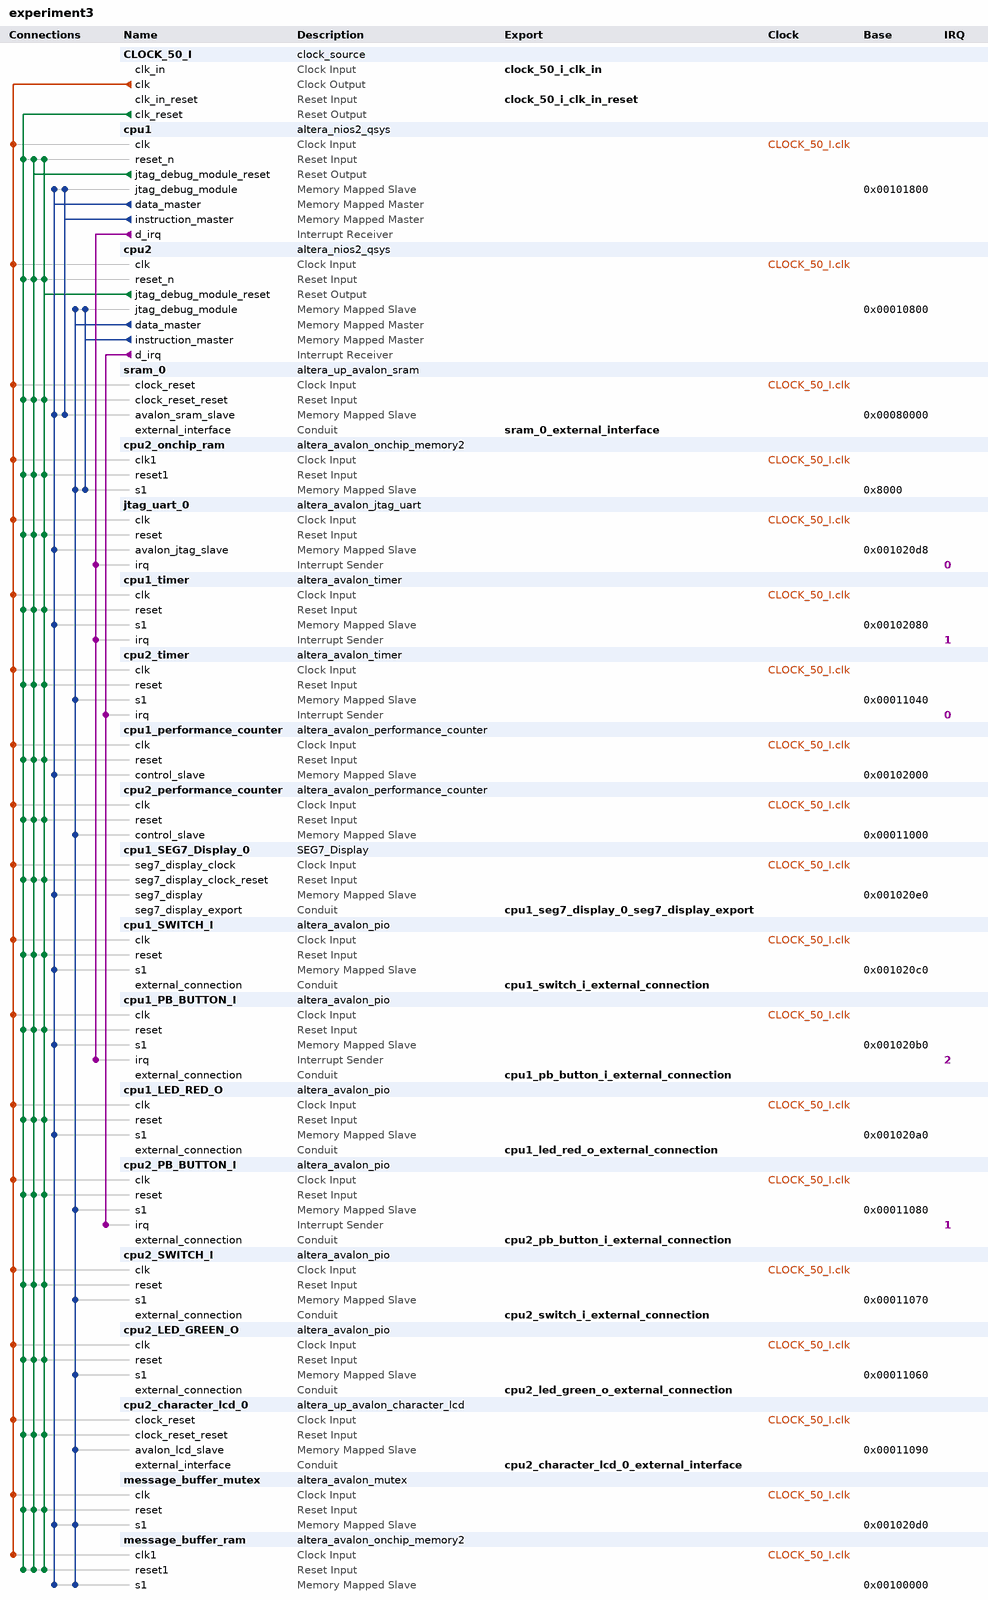
[diagram p0: system contents]
# Platform Designer (Qsys) system experiment3, Cyclone II EP2C35F672C6
# Parameters at their usual value, and those the tool derives, are not listed.
package require -exact qsys 12.0
create_system experiment3
set_project_property DEVICE_FAMILY {Cyclone II}
set_project_property DEVICE EP2C35F672C6

add_instance CLOCK_50_I clock_source 12.0
set_instance_parameter_value CLOCK_50_I clockFrequency 50000000

add_instance cpu1 altera_nios2_qsys 12.0
set_instance_parameter_value cpu1 cpuID 1
set_instance_parameter_value cpu1 resetSlave sram_0.avalon_sram_slave
set_instance_parameter_value cpu1 exceptionSlave sram_0.avalon_sram_slave
set_instance_parameter_value cpu1 breakSlave cpu1.jtag_debug_module
set_instance_parameter_value cpu1 impl Tiny
set_instance_parameter_value cpu1 icache_size 4096

add_instance cpu2 altera_nios2_qsys 12.0
set_instance_parameter_value cpu2 cpuID 2
set_instance_parameter_value cpu2 resetSlave cpu2_onchip_ram.s1
set_instance_parameter_value cpu2 exceptionSlave cpu2_onchip_ram.s1
set_instance_parameter_value cpu2 breakSlave cpu2.jtag_debug_module
set_instance_parameter_value cpu2 impl Tiny
set_instance_parameter_value cpu2 icache_size 4096

add_instance sram_0 altera_up_avalon_sram 11.0
set_instance_parameter_value sram_0 board DE2
set_instance_parameter_value sram_0 pixel_buffer false

add_instance cpu2_onchip_ram altera_avalon_onchip_memory2 12.0
set_instance_parameter_value cpu2_onchip_ram dataWidth 32
set_instance_parameter_value cpu2_onchip_ram dualPort false
set_instance_parameter_value cpu2_onchip_ram initMemContent true
set_instance_parameter_value cpu2_onchip_ram initializationFileName cpu2_onchip_ram
set_instance_parameter_value cpu2_onchip_ram memorySize 32768

add_instance jtag_uart_0 altera_avalon_jtag_uart 12.0
set_instance_parameter_value jtag_uart_0 simInteractiveOptions INTERACTIVE_ASCII_OUTPUT

add_instance cpu1_timer altera_avalon_timer 12.0
set_instance_parameter_value cpu1_timer period 10.0
set_instance_parameter_value cpu1_timer periodUnits MSEC
set_instance_parameter_value cpu1_timer timerPreset FULL_FEATURED

add_instance cpu2_timer altera_avalon_timer 12.0
set_instance_parameter_value cpu2_timer period 10.0
set_instance_parameter_value cpu2_timer periodUnits MSEC
set_instance_parameter_value cpu2_timer timerPreset FULL_FEATURED

add_instance cpu1_performance_counter altera_avalon_performance_counter 12.0
set_instance_parameter_value cpu1_performance_counter numberOfSections 7

add_instance cpu2_performance_counter altera_avalon_performance_counter 12.0
set_instance_parameter_value cpu2_performance_counter numberOfSections 3

add_instance cpu1_SEG7_Display_0 SEG7_Display 1.0

add_instance cpu1_SWITCH_I altera_avalon_pio 12.0
set_instance_parameter_value cpu1_SWITCH_I direction Input
set_instance_parameter_value cpu1_SWITCH_I width 8

add_instance cpu1_PB_BUTTON_I altera_avalon_pio 12.0
set_instance_parameter_value cpu1_PB_BUTTON_I captureEdge true
set_instance_parameter_value cpu1_PB_BUTTON_I direction Input
set_instance_parameter_value cpu1_PB_BUTTON_I generateIRQ true
set_instance_parameter_value cpu1_PB_BUTTON_I irqType EDGE
set_instance_parameter_value cpu1_PB_BUTTON_I width 2

add_instance cpu1_LED_RED_O altera_avalon_pio 12.0
set_instance_parameter_value cpu1_LED_RED_O direction Output
set_instance_parameter_value cpu1_LED_RED_O width 18

add_instance cpu2_PB_BUTTON_I altera_avalon_pio 12.0
set_instance_parameter_value cpu2_PB_BUTTON_I captureEdge true
set_instance_parameter_value cpu2_PB_BUTTON_I direction Input
set_instance_parameter_value cpu2_PB_BUTTON_I generateIRQ true
set_instance_parameter_value cpu2_PB_BUTTON_I irqType EDGE
set_instance_parameter_value cpu2_PB_BUTTON_I width 2

add_instance cpu2_SWITCH_I altera_avalon_pio 12.0
set_instance_parameter_value cpu2_SWITCH_I direction Input
set_instance_parameter_value cpu2_SWITCH_I width 8

add_instance cpu2_LED_GREEN_O altera_avalon_pio 12.0
set_instance_parameter_value cpu2_LED_GREEN_O direction Output
set_instance_parameter_value cpu2_LED_GREEN_O width 9

add_instance cpu2_character_lcd_0 altera_up_avalon_character_lcd 11.0
set_instance_parameter_value cpu2_character_lcd_0 cursor Normal

add_instance message_buffer_mutex altera_avalon_mutex 12.0

add_instance message_buffer_ram altera_avalon_onchip_memory2 12.0
set_instance_parameter_value message_buffer_ram dataWidth 32
set_instance_parameter_value message_buffer_ram dualPort false
set_instance_parameter_value message_buffer_ram initMemContent true
set_instance_parameter_value message_buffer_ram initializationFileName message_buffer_ram
set_instance_parameter_value message_buffer_ram memorySize 4096

# connections
add_connection CLOCK_50_I.clk cpu1.clk clock
add_connection CLOCK_50_I.clk cpu1_LED_RED_O.clk clock
add_connection CLOCK_50_I.clk cpu1_PB_BUTTON_I.clk clock
add_connection CLOCK_50_I.clk cpu1_performance_counter.clk clock
add_connection CLOCK_50_I.clk cpu1_SEG7_Display_0.seg7_display_clock clock
add_connection CLOCK_50_I.clk cpu1_SWITCH_I.clk clock
add_connection CLOCK_50_I.clk cpu1_timer.clk clock
add_connection CLOCK_50_I.clk cpu2.clk clock
add_connection CLOCK_50_I.clk cpu2_character_lcd_0.clock_reset clock
add_connection CLOCK_50_I.clk cpu2_LED_GREEN_O.clk clock
add_connection CLOCK_50_I.clk cpu2_onchip_ram.clk1 clock
add_connection CLOCK_50_I.clk cpu2_PB_BUTTON_I.clk clock
add_connection CLOCK_50_I.clk cpu2_performance_counter.clk clock
add_connection CLOCK_50_I.clk cpu2_SWITCH_I.clk clock
add_connection CLOCK_50_I.clk cpu2_timer.clk clock
add_connection CLOCK_50_I.clk jtag_uart_0.clk clock
add_connection CLOCK_50_I.clk message_buffer_mutex.clk clock
add_connection CLOCK_50_I.clk message_buffer_ram.clk1 clock
add_connection CLOCK_50_I.clk sram_0.clock_reset clock
add_connection CLOCK_50_I.clk_reset cpu1.reset_n reset
add_connection CLOCK_50_I.clk_reset cpu1_LED_RED_O.reset reset
add_connection CLOCK_50_I.clk_reset cpu1_PB_BUTTON_I.reset reset
add_connection CLOCK_50_I.clk_reset cpu1_performance_counter.reset reset
add_connection CLOCK_50_I.clk_reset cpu1_SEG7_Display_0.seg7_display_clock_reset reset
add_connection CLOCK_50_I.clk_reset cpu1_SWITCH_I.reset reset
add_connection CLOCK_50_I.clk_reset cpu1_timer.reset reset
add_connection CLOCK_50_I.clk_reset cpu2.reset_n reset
add_connection CLOCK_50_I.clk_reset cpu2_character_lcd_0.clock_reset_reset reset
add_connection CLOCK_50_I.clk_reset cpu2_LED_GREEN_O.reset reset
add_connection CLOCK_50_I.clk_reset cpu2_onchip_ram.reset1 reset
add_connection CLOCK_50_I.clk_reset cpu2_PB_BUTTON_I.reset reset
add_connection CLOCK_50_I.clk_reset cpu2_performance_counter.reset reset
add_connection CLOCK_50_I.clk_reset cpu2_SWITCH_I.reset reset
add_connection CLOCK_50_I.clk_reset cpu2_timer.reset reset
add_connection CLOCK_50_I.clk_reset jtag_uart_0.reset reset
add_connection CLOCK_50_I.clk_reset message_buffer_mutex.reset reset
add_connection CLOCK_50_I.clk_reset message_buffer_ram.reset1 reset
add_connection CLOCK_50_I.clk_reset sram_0.clock_reset_reset reset
add_connection cpu1.jtag_debug_module_reset cpu1.reset_n reset
add_connection cpu1.jtag_debug_module_reset cpu1_LED_RED_O.reset reset
add_connection cpu1.jtag_debug_module_reset cpu1_PB_BUTTON_I.reset reset
add_connection cpu1.jtag_debug_module_reset cpu1_performance_counter.reset reset
add_connection cpu1.jtag_debug_module_reset cpu1_SEG7_Display_0.seg7_display_clock_reset reset
add_connection cpu1.jtag_debug_module_reset cpu1_SWITCH_I.reset reset
add_connection cpu1.jtag_debug_module_reset cpu1_timer.reset reset
add_connection cpu1.jtag_debug_module_reset cpu2.reset_n reset
add_connection cpu1.jtag_debug_module_reset cpu2_character_lcd_0.clock_reset_reset reset
add_connection cpu1.jtag_debug_module_reset cpu2_LED_GREEN_O.reset reset
add_connection cpu1.jtag_debug_module_reset cpu2_onchip_ram.reset1 reset
add_connection cpu1.jtag_debug_module_reset cpu2_PB_BUTTON_I.reset reset
add_connection cpu1.jtag_debug_module_reset cpu2_performance_counter.reset reset
add_connection cpu1.jtag_debug_module_reset cpu2_SWITCH_I.reset reset
add_connection cpu1.jtag_debug_module_reset cpu2_timer.reset reset
add_connection cpu1.jtag_debug_module_reset jtag_uart_0.reset reset
add_connection cpu1.jtag_debug_module_reset message_buffer_mutex.reset reset
add_connection cpu1.jtag_debug_module_reset message_buffer_ram.reset1 reset
add_connection cpu1.jtag_debug_module_reset sram_0.clock_reset_reset reset
add_connection cpu2.jtag_debug_module_reset cpu1.reset_n reset
add_connection cpu2.jtag_debug_module_reset cpu1_LED_RED_O.reset reset
add_connection cpu2.jtag_debug_module_reset cpu1_PB_BUTTON_I.reset reset
add_connection cpu2.jtag_debug_module_reset cpu1_performance_counter.reset reset
add_connection cpu2.jtag_debug_module_reset cpu1_SEG7_Display_0.seg7_display_clock_reset reset
add_connection cpu2.jtag_debug_module_reset cpu1_SWITCH_I.reset reset
add_connection cpu2.jtag_debug_module_reset cpu1_timer.reset reset
add_connection cpu2.jtag_debug_module_reset cpu2.reset_n reset
add_connection cpu2.jtag_debug_module_reset cpu2_character_lcd_0.clock_reset_reset reset
add_connection cpu2.jtag_debug_module_reset cpu2_LED_GREEN_O.reset reset
add_connection cpu2.jtag_debug_module_reset cpu2_onchip_ram.reset1 reset
add_connection cpu2.jtag_debug_module_reset cpu2_PB_BUTTON_I.reset reset
add_connection cpu2.jtag_debug_module_reset cpu2_performance_counter.reset reset
add_connection cpu2.jtag_debug_module_reset cpu2_SWITCH_I.reset reset
add_connection cpu2.jtag_debug_module_reset cpu2_timer.reset reset
add_connection cpu2.jtag_debug_module_reset jtag_uart_0.reset reset
add_connection cpu2.jtag_debug_module_reset message_buffer_mutex.reset reset
add_connection cpu2.jtag_debug_module_reset message_buffer_ram.reset1 reset
add_connection cpu2.jtag_debug_module_reset sram_0.clock_reset_reset reset
add_connection cpu1.data_master cpu1.jtag_debug_module avalon
set_connection_parameter_value cpu1.data_master/cpu1.jtag_debug_module baseAddress 0x00101800
add_connection cpu1.data_master cpu1_LED_RED_O.s1 avalon
set_connection_parameter_value cpu1.data_master/cpu1_LED_RED_O.s1 baseAddress 0x001020a0
add_connection cpu1.data_master cpu1_PB_BUTTON_I.s1 avalon
set_connection_parameter_value cpu1.data_master/cpu1_PB_BUTTON_I.s1 baseAddress 0x001020b0
add_connection cpu1.data_master cpu1_performance_counter.control_slave avalon
set_connection_parameter_value cpu1.data_master/cpu1_performance_counter.control_slave baseAddress 0x00102000
add_connection cpu1.data_master cpu1_SEG7_Display_0.seg7_display avalon
set_connection_parameter_value cpu1.data_master/cpu1_SEG7_Display_0.seg7_display baseAddress 0x001020e0
add_connection cpu1.data_master cpu1_SWITCH_I.s1 avalon
set_connection_parameter_value cpu1.data_master/cpu1_SWITCH_I.s1 baseAddress 0x001020c0
add_connection cpu1.data_master cpu1_timer.s1 avalon
set_connection_parameter_value cpu1.data_master/cpu1_timer.s1 baseAddress 0x00102080
add_connection cpu1.data_master jtag_uart_0.avalon_jtag_slave avalon
set_connection_parameter_value cpu1.data_master/jtag_uart_0.avalon_jtag_slave baseAddress 0x001020d8
add_connection cpu1.data_master message_buffer_mutex.s1 avalon
set_connection_parameter_value cpu1.data_master/message_buffer_mutex.s1 baseAddress 0x001020d0
add_connection cpu1.data_master message_buffer_ram.s1 avalon
set_connection_parameter_value cpu1.data_master/message_buffer_ram.s1 baseAddress 0x00100000
add_connection cpu1.data_master sram_0.avalon_sram_slave avalon
set_connection_parameter_value cpu1.data_master/sram_0.avalon_sram_slave baseAddress 0x00080000
add_connection cpu1.instruction_master cpu1.jtag_debug_module avalon
set_connection_parameter_value cpu1.instruction_master/cpu1.jtag_debug_module baseAddress 0x00101800
add_connection cpu1.instruction_master sram_0.avalon_sram_slave avalon
set_connection_parameter_value cpu1.instruction_master/sram_0.avalon_sram_slave baseAddress 0x00080000
add_connection cpu2.data_master cpu2.jtag_debug_module avalon
set_connection_parameter_value cpu2.data_master/cpu2.jtag_debug_module baseAddress 0x00010800
add_connection cpu2.data_master cpu2_character_lcd_0.avalon_lcd_slave avalon
set_connection_parameter_value cpu2.data_master/cpu2_character_lcd_0.avalon_lcd_slave baseAddress 0x00011090
add_connection cpu2.data_master cpu2_LED_GREEN_O.s1 avalon
set_connection_parameter_value cpu2.data_master/cpu2_LED_GREEN_O.s1 baseAddress 0x00011060
add_connection cpu2.data_master cpu2_onchip_ram.s1 avalon
set_connection_parameter_value cpu2.data_master/cpu2_onchip_ram.s1 baseAddress 0x8000
add_connection cpu2.data_master cpu2_PB_BUTTON_I.s1 avalon
set_connection_parameter_value cpu2.data_master/cpu2_PB_BUTTON_I.s1 baseAddress 0x00011080
add_connection cpu2.data_master cpu2_performance_counter.control_slave avalon
set_connection_parameter_value cpu2.data_master/cpu2_performance_counter.control_slave baseAddress 0x00011000
add_connection cpu2.data_master cpu2_SWITCH_I.s1 avalon
set_connection_parameter_value cpu2.data_master/cpu2_SWITCH_I.s1 baseAddress 0x00011070
add_connection cpu2.data_master cpu2_timer.s1 avalon
set_connection_parameter_value cpu2.data_master/cpu2_timer.s1 baseAddress 0x00011040
add_connection cpu2.data_master message_buffer_mutex.s1 avalon
set_connection_parameter_value cpu2.data_master/message_buffer_mutex.s1 baseAddress 0x001020d0
add_connection cpu2.data_master message_buffer_ram.s1 avalon
set_connection_parameter_value cpu2.data_master/message_buffer_ram.s1 baseAddress 0x00100000
add_connection cpu2.instruction_master cpu2.jtag_debug_module avalon
set_connection_parameter_value cpu2.instruction_master/cpu2.jtag_debug_module baseAddress 0x00010800
add_connection cpu2.instruction_master cpu2_onchip_ram.s1 avalon
set_connection_parameter_value cpu2.instruction_master/cpu2_onchip_ram.s1 baseAddress 0x8000
add_connection cpu1.d_irq cpu1_PB_BUTTON_I.irq interrupt
set_connection_parameter_value cpu1.d_irq/cpu1_PB_BUTTON_I.irq irqNumber 2
add_connection cpu1.d_irq cpu1_timer.irq interrupt
set_connection_parameter_value cpu1.d_irq/cpu1_timer.irq irqNumber 1
add_connection cpu1.d_irq jtag_uart_0.irq interrupt
set_connection_parameter_value cpu1.d_irq/jtag_uart_0.irq irqNumber 0
add_connection cpu2.d_irq cpu2_PB_BUTTON_I.irq interrupt
set_connection_parameter_value cpu2.d_irq/cpu2_PB_BUTTON_I.irq irqNumber 1
add_connection cpu2.d_irq cpu2_timer.irq interrupt
set_connection_parameter_value cpu2.d_irq/cpu2_timer.irq irqNumber 0

# exported interfaces
add_interface clock_50_i_clk_in clock sink
set_interface_property clock_50_i_clk_in EXPORT_OF CLOCK_50_I.clk_in
add_interface clock_50_i_clk_in_reset reset sink
set_interface_property clock_50_i_clk_in_reset EXPORT_OF CLOCK_50_I.clk_in_reset
add_interface sram_0_external_interface conduit end
set_interface_property sram_0_external_interface EXPORT_OF sram_0.external_interface
add_interface cpu1_seg7_display_0_seg7_display_export conduit end
set_interface_property cpu1_seg7_display_0_seg7_display_export EXPORT_OF cpu1_SEG7_Display_0.seg7_display_export
add_interface cpu1_switch_i_external_connection conduit end
set_interface_property cpu1_switch_i_external_connection EXPORT_OF cpu1_SWITCH_I.external_connection
add_interface cpu1_pb_button_i_external_connection conduit end
set_interface_property cpu1_pb_button_i_external_connection EXPORT_OF cpu1_PB_BUTTON_I.external_connection
add_interface cpu1_led_red_o_external_connection conduit end
set_interface_property cpu1_led_red_o_external_connection EXPORT_OF cpu1_LED_RED_O.external_connection
add_interface cpu2_pb_button_i_external_connection conduit end
set_interface_property cpu2_pb_button_i_external_connection EXPORT_OF cpu2_PB_BUTTON_I.external_connection
add_interface cpu2_switch_i_external_connection conduit end
set_interface_property cpu2_switch_i_external_connection EXPORT_OF cpu2_SWITCH_I.external_connection
add_interface cpu2_led_green_o_external_connection conduit end
set_interface_property cpu2_led_green_o_external_connection EXPORT_OF cpu2_LED_GREEN_O.external_connection
add_interface cpu2_character_lcd_0_external_interface conduit end
set_interface_property cpu2_character_lcd_0_external_interface EXPORT_OF cpu2_character_lcd_0.external_interface

save_system experiment3.qsys
